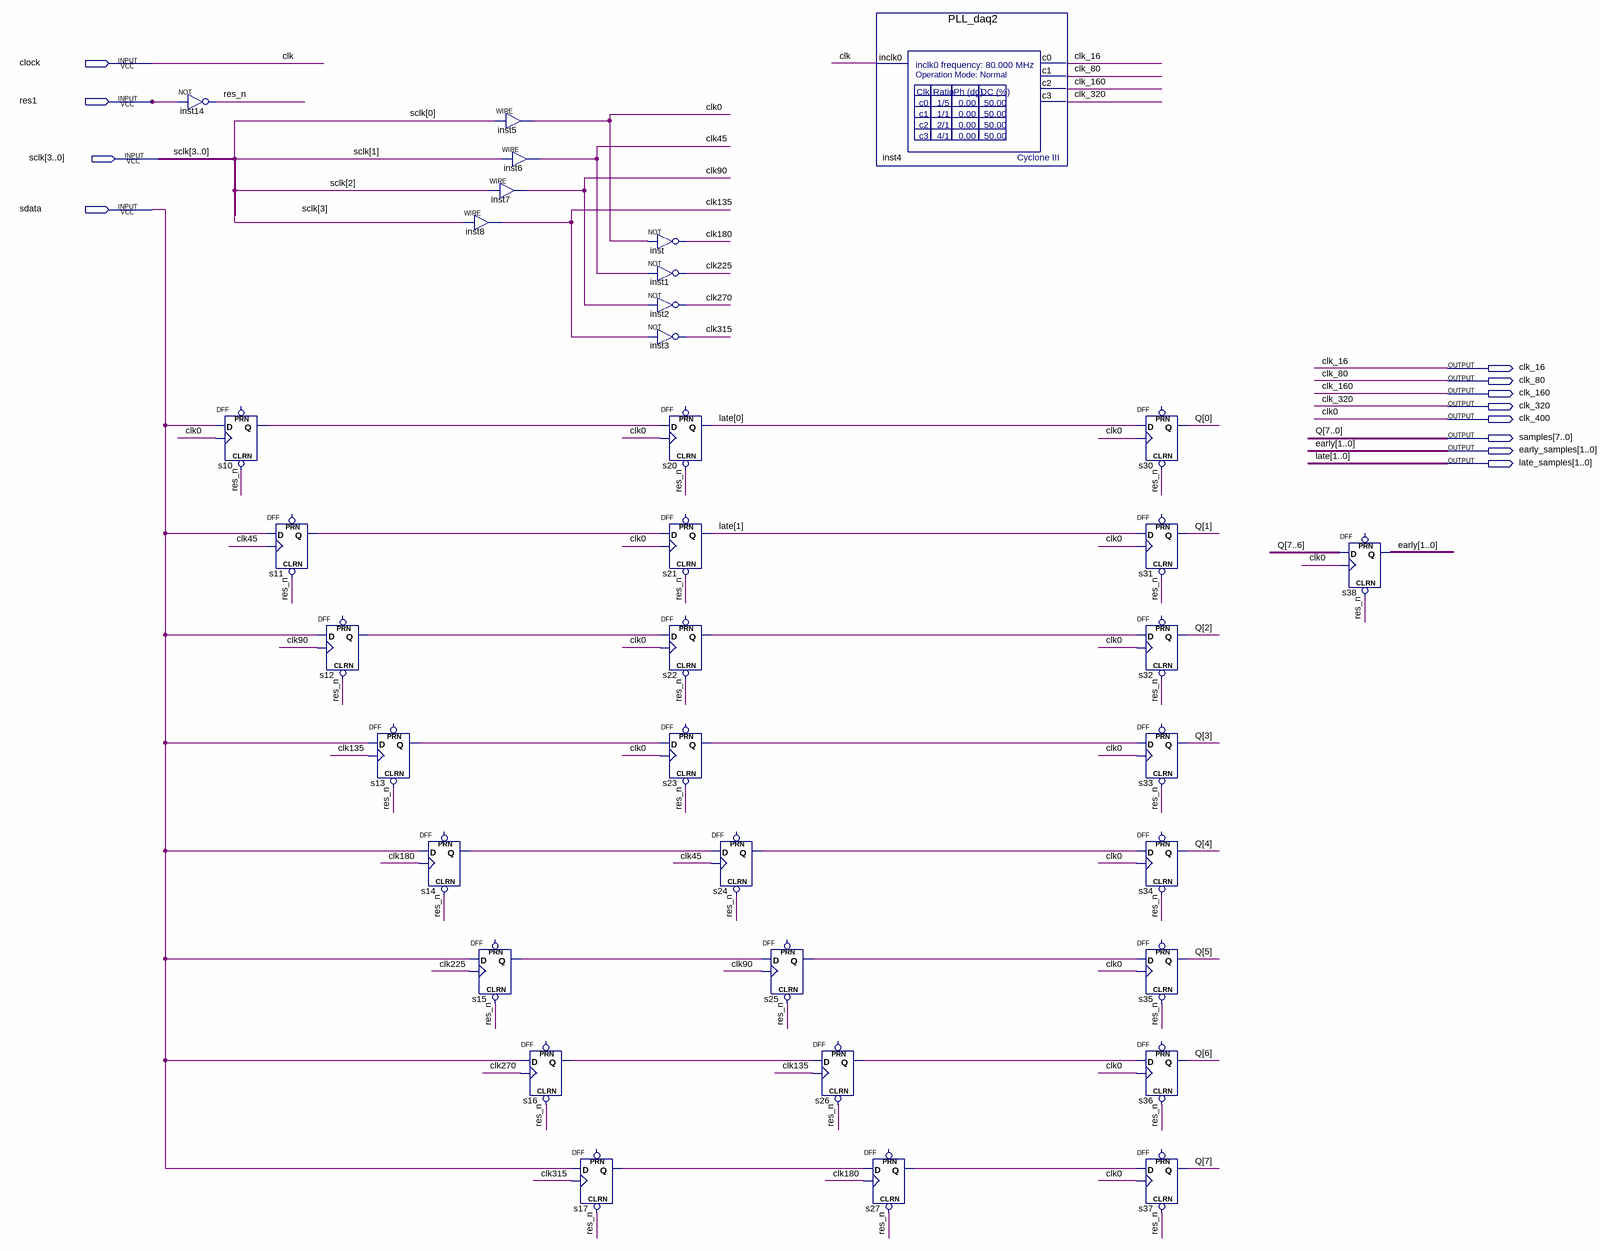
[diagram p0: schematic sheet]
// Quartus schematic Timer_Sampler.bdf as structural Verilog: 35 symbols, 12 pins
module Timer_Sampler (
  input  clock,
  input  res1,
  input  [3:0] sclk,
  input  sdata,
  output clk_16,
  output clk_80,
  output clk_160,
  output clk_320,
  output clk_400,
  output [7:0] samples,
  output [1:0] early_samples,
  output [1:0] late_samples
);

  wire clk45, clk90, clk135, clk180, clk225, clk270, clk315, res_n, s10_q, s11_q, s12_q, s13_q, s14_q, s15_q,
       s16_q, s17_q, s22_q, s23_q, s24_q, s25_q, s26_q, s27_q;

  not inst14 (res_n, res1);
  DFF s10 (.CLRN(res_n), .CLK(clk_400), .D(sdata), .Q(s10_q));  // open: PRN
  DFF s11 (.CLRN(res_n), .CLK(clk45), .D(sdata), .Q(s11_q));  // open: PRN
  DFF s12 (.CLRN(res_n), .CLK(clk90), .D(sdata), .Q(s12_q));  // open: PRN
  DFF s13 (.CLRN(res_n), .CLK(clk135), .D(sdata), .Q(s13_q));  // open: PRN
  DFF s14 (.CLRN(res_n), .CLK(clk180), .D(sdata), .Q(s14_q));  // open: PRN
  assign clk_400 = sclk[0];  // WIRE inst5
  assign clk45 = sclk[1];  // WIRE inst6
  assign clk90 = sclk[2];  // WIRE inst7
  assign clk135 = sclk[3];  // WIRE inst8
  DFF s15 (.CLRN(res_n), .CLK(clk225), .D(sdata), .Q(s15_q));  // open: PRN
  DFF s16 (.CLRN(res_n), .CLK(clk270), .D(sdata), .Q(s16_q));  // open: PRN
  DFF s17 (.CLRN(res_n), .CLK(clk315), .D(sdata), .Q(s17_q));  // open: PRN
  not inst (clk180, clk_400);
  not inst1 (clk225, clk45);
  not inst2 (clk270, clk90);
  not inst3 (clk315, clk135);
  DFF s20 (.CLRN(res_n), .CLK(clk_400), .D(s10_q), .Q(late_samples[0]));  // open: PRN
  DFF s21 (.CLRN(res_n), .CLK(clk_400), .D(s11_q), .Q(late_samples[1]));  // open: PRN
  DFF s22 (.CLRN(res_n), .CLK(clk_400), .D(s12_q), .Q(s22_q));  // open: PRN
  DFF s23 (.CLRN(res_n), .CLK(clk_400), .D(s13_q), .Q(s23_q));  // open: PRN
  DFF s24 (.CLRN(res_n), .CLK(clk45), .D(s14_q), .Q(s24_q));  // open: PRN
  DFF s25 (.CLRN(res_n), .CLK(clk90), .D(s15_q), .Q(s25_q));  // open: PRN
  DFF s26 (.CLRN(res_n), .CLK(clk135), .D(s16_q), .Q(s26_q));  // open: PRN
  PLL_daq2 inst4 (.inclk0(clock), .c0(clk_16), .c1(clk_80), .c2(clk_160), .c3(clk_320));
  DFF s27 (.CLRN(res_n), .CLK(clk180), .D(s17_q), .Q(s27_q));  // open: PRN
  DFF s30 (.CLRN(res_n), .CLK(clk_400), .D(late_samples[0]), .Q(samples[0]));  // open: PRN
  DFF s31 (.CLRN(res_n), .CLK(clk_400), .D(late_samples[1]), .Q(samples[1]));  // open: PRN
  DFF s32 (.CLRN(res_n), .CLK(clk_400), .D(s22_q), .Q(samples[2]));  // open: PRN
  DFF s33 (.CLRN(res_n), .CLK(clk_400), .D(s23_q), .Q(samples[3]));  // open: PRN
  DFF s34 (.CLRN(res_n), .CLK(clk_400), .D(s24_q), .Q(samples[4]));  // open: PRN
  DFF s35 (.CLRN(res_n), .CLK(clk_400), .D(s25_q), .Q(samples[5]));  // open: PRN
  DFF s36 (.CLRN(res_n), .CLK(clk_400), .D(s26_q), .Q(samples[6]));  // open: PRN
  DFF s37 (.CLRN(res_n), .CLK(clk_400), .D(s27_q), .Q(samples[7]));  // open: PRN
  DFF s38[1:0] (.CLRN(res_n), .CLK(clk_400), .D(samples[7:6]), .Q(early_samples));  // open: PRN

  // Other names for the same wires on the sheet: clk = clock; clk0 = clk_400; early[1:0] = early_samples;
  //   late[1:0] = late_samples; Q[7:0] = samples
endmodule
